# EAGLE design Grove-BLE (dual model) v1.0 (EAGLE 7.1.0)

## Sheet 1 of 2
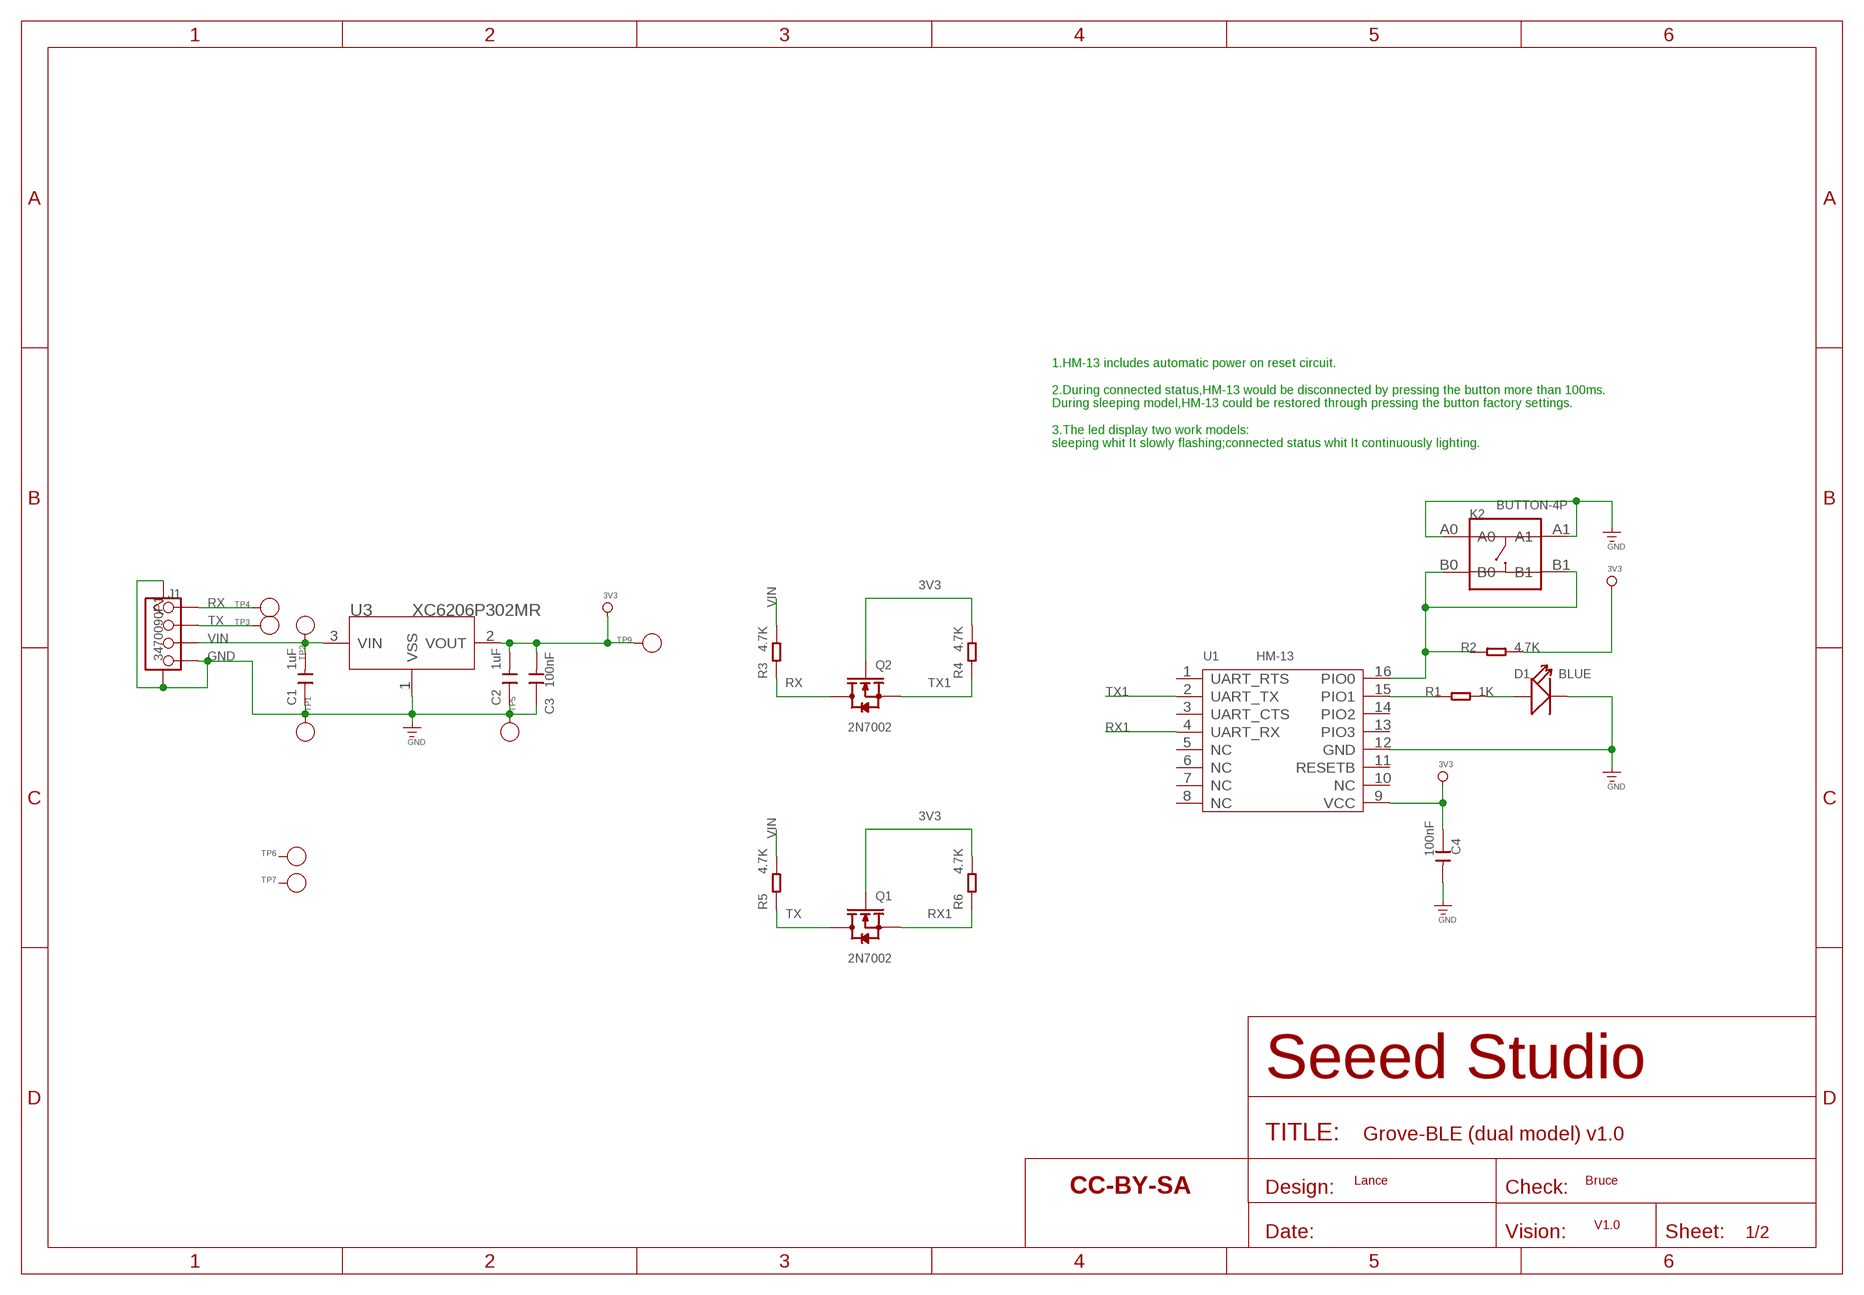
[diagram p0: schematic, sheet 1]

### Parts
C1  1uF  C-0603  [C0603]
C2  1uF  C-0603  [C0603]
C3  100nF  C-0603  [C0603]
C4  100nF  C-0603  [C0603]
D1  BLUE  LED'0603'  [LED-0603]
J1  3470090P1  TWIG-4P-2.0-SMD-FEMALE-REINFORCE'DD'  [4P-SMD-2.0]
K2  BUTTON-4P  BUTTON-4P-3.3X3.3  [4P-SMD-L3.35*W3.35*H1.5MM]
Q1  2N7002  MOSFET-N'SOT23'  [SOT23]
Q2  2N7002  MOSFET-N'SOT23'  [SOT23]
R1  1K  R-0603  [R0603]
R2  4.7K  R-0603  [R0603]
R3  4.7K  R-0603  [R0603]
R4  4.7K  R-0603  [R0603]
R5  4.7K  R-0603  [R0603]
R6  4.7K  R-0603  [R0603]
TP1  GND  PAD-TEST-POINT'4545'  [TP_4545]
TP2  VIN  PAD-TEST-POINT'4545'  [TP_4545]
TP3  RX  PAD-TEST-POINT'4545'  [TP_4545]
TP4  TX  PAD-TEST-POINT'4545'  [TP_4545]
TP5  PAD-TEST-POINT'4545'  [TP_4545]
TP6  PAD-TEST-POINT'4545'  [TP_4545]
TP7  PAD-TEST-POINT'4545'  [TP_4545]
TP9  3V3  PAD-TEST-POINT'4545'  [TP_4545]
U1  HM-13  MOUDLE-BLUETOOTH-HM-13  [16P-L18.5*W13.5*H2.3MM]
U3  XC6206P302MR  XC6206MR  [SOT23]
U$1  SEEEDSTUDIO-OPEN-SCH-FRAME  [SEEEDSTUDIO-PCB-FRAME]

### Nets
3V3: C2.2 C3.2 C4.1 Q1.1(G) Q2.1(G) R2.2 R4.2 R6.2 TP9.T U1.9(VCC) U3.2(VOUT)
GND: C1.1 C2.1 C3.1 C4.2 D1.- J1.4 J1.SS1 J1.SS2 K2.A0 K2.A1 TP1.T TP5.T U1.12(GND) U3.1(VSS)
N$7: R1.1 U1.15(PIO1)
N$8: D1.+ R1.2
N$11: K2.B0 K2.B1 R2.1 U1.16(PIO0)
RX: J1.1 Q2.3(D) R3.1 TP4.T
RX1: Q1.2(S) R6.1 U1.4(UART_RX)
TX: J1.2 Q1.3(D) R5.1 TP3.T
TX1: Q2.2(S) R4.1 U1.2(UART_TX)
VIN: C1.2 J1.3 R3.2 R5.2 TP2.T U3.3(VIN)
Unconnected: TP6.T TP7.T U1.1(UART_RTS) U1.3(UART_CTS) U1.5(NC) U1.6(NC) U1.7(NC) U1.8(NC) U1.10(NC) U1.11(RESETB) U1.13(PIO3) U1.14(PIO2)

### Notes on the sheet
- 1.HM-13 includes automatic power on reset circuit.
   
  2.During connected status,HM-13 would be disconnected by pressing the button more than 100ms.
  During sleeping model,HM-13 could be restored through pressing the button factory settings.
  
  3.The led display two work models:
  sleeping whit It slowly flashing;connected status whit It continuously lighting.
- Lance | Bruce
- V1.0

## Sheet 2 of 2
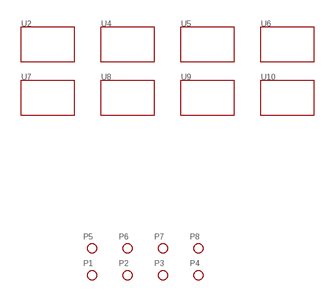
[diagram p1: schematic, sheet 2]

### Parts
P1  PAD-MARK  [ROUND-MARK-1.0]
P2  PAD-MARK  [ROUND-MARK-1.0]
P3  PAD-MARK  [ROUND-MARK-1.0]
P4  PAD-MARK  [ROUND-MARK-1.0]
P5  PAD-MARK  [ROUND-MARK-1.0]
P6  PAD-MARK  [ROUND-MARK-1.0]
P7  PAD-MARK  [ROUND-MARK-1.0]
P8  PAD-MARK  [ROUND-MARK-1.0]
U2  TWIG'2U'  [GROVE-TEST-PLATFORM]
U4  TWIG'2U'  [GROVE-TEST-PLATFORM]
U5  TWIG'2U'  [GROVE-TEST-PLATFORM]
U6  TWIG'2U'  [GROVE-TEST-PLATFORM]
U7  TWIG'2U'  [GROVE-TEST-PLATFORM]
U8  TWIG'2U'  [GROVE-TEST-PLATFORM]
U9  TWIG'2U'  [GROVE-TEST-PLATFORM]
U10  TWIG'2U'  [GROVE-TEST-PLATFORM]

## Library data of the parts
C1-C4 = Discrete:C*: Ceramic Capacitors
D1 = Discrete-new:LED
J1 = Connector :TWIG-4P-2.0-SMD-FEMALE-REINFORCE
K2 = Discrete-new:BUTTON-4P: 4P-L6.0*W6.0*H5.0mm:311020024;4P-L8.0*W8.0*H9.0MM:311020028;4P-SMD-L6.0*W6.0*H5.0MM:311020004;4P-SMD-L3.35*W3.35*H1.5MM:311020030;4P-SMD-L5.2*W5.2*H2.5:311020046
P1-P8 = Discrete:PAD-MARK; PARTNO: DNP
Q1 Q2 = Discrete:MOSFET-N: IRLL014: http://www.vishay.com/docs/91319/sihll014.pdf
R1-R6 = Discrete:R*
TP1-TP7 TP9 = Discrete:PAD-TEST-POINT; PARTNO: DNP
U1 = template:MOUDLE-BLUETOOTH-HM-13: Bluetooth Specification V4.0 EDR and BLE
U2 U4-U10 = template:TWIG
U3 = IC:XC6206: LOW ESR Cap.Compatible Positive Voltage Regulators
U$1 = moudle-new:SEEEDSTUDIO-OPEN-SCH-FRAME

## Board
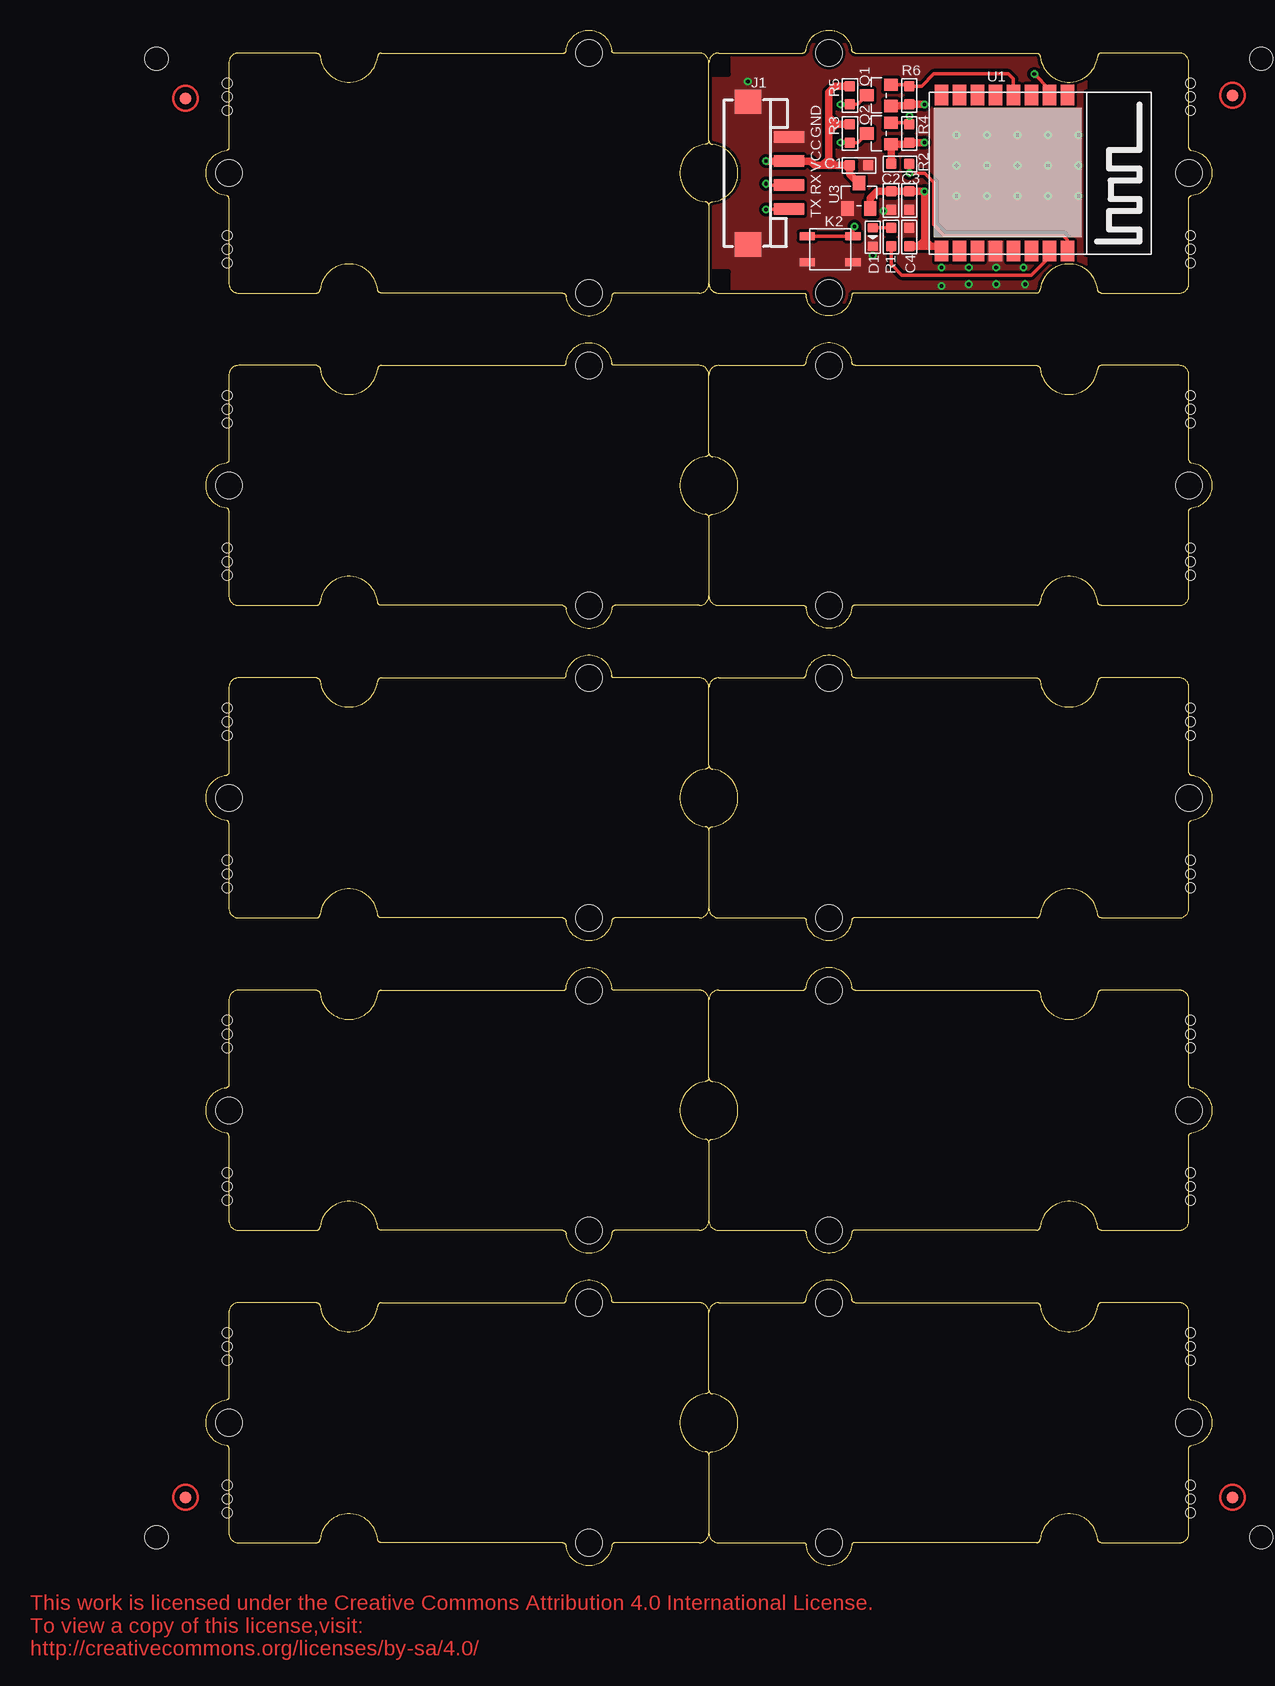
[diagram p2: board, top side]
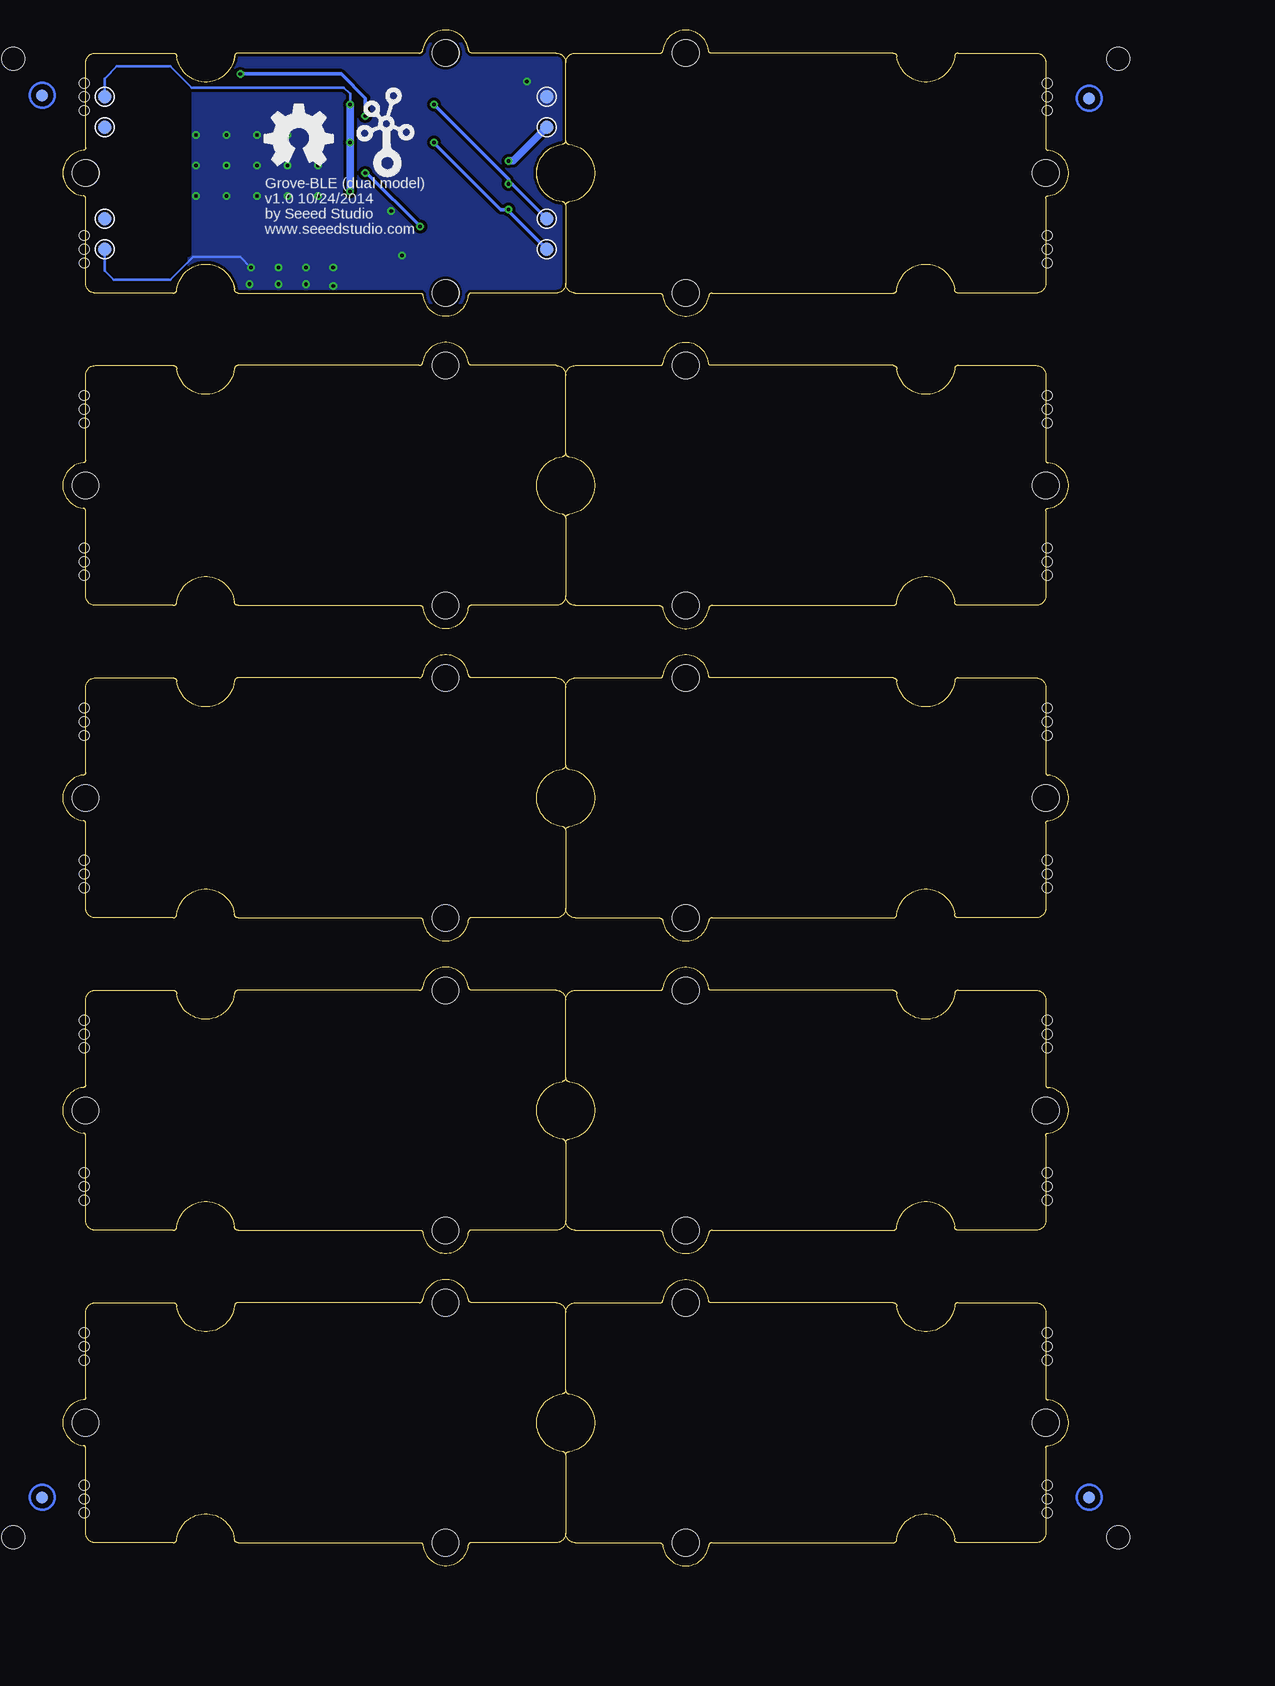
[diagram p3: board, bottom side, seen from below]

Size 83.82 x 127.98 mm. Coordinates in mm from the lower left corner, seen from the top.
Copper layers (1*16): Top 0.035mm / dielectric 1.5mm / Bottom 0.035mm
Design rules "SeeedStudio_2layer_DRU_no_angle_20140221 *": minimum track width 6mil, minimum drill 12mil, track to track 6mil, track to pad 6mil, pad to pad 6mil, via to via 6mil, smd to smd 0mil, copper to edge 10mil, drill to drill 10mil, minimum pad ring 10mil, minimum via ring 6mil, stop-mask expansion 2mil, vias tented up to drill 100mil, thermal gap 10mil
Holes 0.8 mm at 1.78,123.55 1.78,121.27 1.78,122.41 1.78,110.85 1.78,108.57 1.78,109.71 1.78,97.52 1.78,95.23 1.78,96.38 1.78,84.82 1.78,82.53 1.78,83.68 1.78,71.48 1.78,69.2 1.78,70.34 1.78,58.78 1.78,56.5 1.78,57.64 1.78,45.45 1.78,43.16 1.78,44.31 1.78,32.75 1.78,30.46 1.78,31.61 1.78,19.41 1.78,17.13 1.78,18.27 1.78,6.71 1.78,4.43 1.78,5.57 82.04,121.27 82.04,123.55 82.04,122.41 82.04,108.57 82.04,110.85 82.04,109.71 82.04,95.23 82.04,97.52 82.04,96.38 82.04,82.53 82.04,84.82 82.04,83.68 82.04,69.2 82.04,71.48 82.04,70.34 82.04,56.5 82.04,58.78 82.04,57.64 82.04,43.16 82.04,45.45 82.04,44.31 82.04,30.46 82.04,32.75 82.04,31.61 82.04,17.13 82.04,19.41 82.04,18.27 82.04,4.43 82.04,6.71 82.04,5.57
Holes 1.91 mm at -4.13,2.4 87.95,2.4 87.95,125.59 -4.13,125.59

### Footprints (pad centres in the part's own frame; a part is rotated, then mirrored left to right if it is on the bottom)
C0603 = smd 0.889 x 0.889: 1 -0.762,0; 2 0.762,0
LED-0603 = smd 0.762 x 0.889: + -0.762,0; - 0.762,0
4P-SMD-2.0 = smd 0.965 x 2.54: 1 -3,0; 2 -1,0; 3 1,0; 4 3,0 | smd 2.032 x 2.184: SS1 -5.946,3.4; SS2 5.946,3.4
4P-SMD-L3.35*W3.35*H1.5MM = smd 1.27 x 0.635: A0 -1.905,1.079; A1 1.905,1.079; B0 -1.905,-1.079; B1 1.905,-1.079
ROUND-MARK-1.0 = smd 1.016 x 1.016: P$1 0,0
SOT23 = smd 1.016 x 1.143: 1 -0.889,-1.016; 2 0.889,-1.016; 3 0,1.016
R0603 = smd 0.889 x 0.889: 1 -0.762,0; 2 0.762,0
TP_4545 = smd 1.143 x 1.143: T 0,0
16P-L18.5*W13.5*H2.3MM = smd 1.7 x 1.1: 1 -6.5,2.25; 2 -6.5,0.75; 3 -6.5,-0.75; 4 -6.5,-2.25; 5 -6.5,-3.75; 6 -6.5,-5.25; 7 -6.5,-6.75; 8 -6.5,-8.25; 9 6.5,-8.25; 10 6.5,-6.75; 11 6.5,-5.25; 12 6.5,-3.75; 13 6.5,-2.25; 14 6.5,-0.75; 15 6.5,0.75; 16 6.5,2.25
GROVE-TEST-PLATFORM = hole 2.2: -10,-10; -10,10; 20,0
SOT23' = smd 1.016 x 1.2: 1 -0.95,-1.06; 2 0.95,-1.06; 3 0,1.06
GROVE-TEST-PLATFORM@1 = hole 2.2: -10,-10; -10,10; 20,0
GROVE-1*2-TEST-PLATFORM = hole 2.2: -10,-10; -10,10; 20,0

### Placement (x,y rotation side)
C1  54.41,116.7 180 top
C2  57.09,113.77 90 top
C3  58.61,113.77 90 top
C4  58.61,110.73 90 top
D1  55.56,110.73 270 top
J1  48.57,116.06 90 top
K2  52.01,109.71 180 top
P1  -1.71,5.7 0 top
P2  85.54,5.7 0 top
P3  -1.71,122.28 0 top
P4  85.54,122.54 0 top
P5  -1.71,5.7 0 bottom
P6  85.54,5.7 0 bottom
P7  85.54,122.54 0 bottom
P8  -1.71,122.28 0 bottom
Q1  56.07,122.54 90 top
Q2  56.07,119.36 90 top
R1  57.09,110.73 90 top
R2  57.85,116.82 180 top
R3  53.66,119.36 90 top
R4  58.61,119.36 270 top
R5  53.66,122.54 90 top
R6  58.61,122.54 270 top
TP1  43.49,122.41 180 bottom
TP2  43.5,119.87 180 bottom
TP3  43.5,112.25 270 bottom
TP4  43.5,109.71 180 bottom
TP5  80.33,109.71 180 bottom
TP6  80.33,112.25 180 bottom
TP7  80.33,119.87 180 bottom
TP9  80.33,122.41 0 bottom
U1  69.53,116.06 270 top
U2  61.91,37.96 0 top
U3  XC6206P302MR  [SOT23']  54.41,114.16 0 top
U4  21.91,37.96 180 top
U5  61.91,63.99 0 top
U6  21.91,63.99 180 top
U7  61.91,90.03 0 top
U8  21.91,90.03 180 top
U9  21.91,116.06 180 top
U10  61.91,116.06 0 top
U11  [GROVE-TEST-PLATFORM@1]  61.91,11.92 0 top
U12  [GROVE-TEST-PLATFORM@1]  21.91,11.92 180 top
U$1  -14.67,-7.51 0 top  (outside the outline)
U$5  [GROVE-1*2-TEST-PLATFORM]  61.91,116.06 0 top
U$6  [OSHW_FILLX200_NOTEXT]  66.99,116.7 0 bottom
U$7  [TWIGLOGO]  56.83,116.7 0 bottom

### Tracks (layer width: path | path; a pad name or v marks a point on that pad's centre or on a via)
3V3  (via drill 0.3 pad 0.64)
  Top 0.61: Q1.1 58.48,121.65 R6.2 v59.88,121.78 | U3.2 55.37,113.96 55.94,114.54 C2.2 C3.2 v59.88,114.53 v59.88,114.54 59.88,110.47 | 59.88,110.47 59.88,109.97 | C4.1 59.37,109.97 | 59.37,109.97 59.88,109.97 | 59.88,109.97 60.39,109.97 | 60.39,109.97 60.88,109.97 U1.9 | 59.88,110.47 59.37,109.97 | 59.88,110.47 60.39,109.97 | v59.88,118.6 R4.2 58.48,118.47 Q2.1 R2.2
  Bottom 0.203: TP9.T 80.33,123.94 79.31,124.95 74.87,124.95 73.09,123.17 61.15,123.17 61.02,123.17 60.39,123.17 59.88,122.67 v59.88,121.78
  Bottom 0.61: v59.88,121.78 v59.88,118.6 v59.88,114.54
GND  (via drill 0.3 pad 0.64)
  Bottom 0.203: TP5.T 80.33,107.93 79.57,107.17 74.87,107.17 72.96,109.08 69.03,109.08 v68.14,108.19
  other vias: 45.15,123.68 55.56,109.2 56.45,112.89 62.55,119.24 65.09,119.24 67.63,119.24 70.17,119.24 72.71,119.24 72.71,116.7 62.55,116.7 65.09,116.7 67.63,116.7 70.17,116.7 70.17,114.16 67.63,114.16 65.09,114.16 62.55,114.16 65.85,108.19 68.26,106.79 63.56,108.19 61.28,108.19 61.28,106.66 63.56,106.79 65.85,106.79 72.71,114.16
  pour Top (isolate 0.254, rank 6, no thermals): 41.47,126.86 73.34,126.86 73.34,105.27 41.47,105.27
  pour Bottom (isolate 0.254, rank 6, no thermals): 41.47,126.86 73.34,126.86 73.34,105.27 41.47,105.27
N$7
  Top 0.305: U1.15 70.28,109.06 68.77,107.55 57.98,107.55 57.09,108.44 R1.1
N$8
  Top 0.305: R1.2 D1.+
N$11  (via drill 0.3 pad 0.64)
  Top 0.305: v54.04,111.62 53.91,111.49 K2.B0 K2.B1 | R2.1 v58.61,116.06 59.88,116.06 60.64,115.3 60.64,111.74 61.53,110.85 71.44,110.85 71.78,110.51 U1.16
  Bottom 0.305: v58.61,116.06 58.48,116.06 v54.04,111.62
RX  (via drill 0.3 pad 0.64)
  Top 0.305: Q2.3 54.29,118.6 R3.1 v52.9,118.6 | J1.1 46.72,113.06 v46.67,113.01
  Bottom 0.305: TP4.T 46.67,112.89 v46.67,113.01 47.31,113.01 v52.9,118.6
RX1
  Top 0.305: Q1.2 58.48,123.43 R6.1 59.63,123.3 60.64,124.32 66.87,124.32 67.28,123.9 U1.4
TX  (via drill 0.3 pad 0.64)
  Top 0.305: Q1.3 54.29,121.78 R5.1 v52.9,121.78 | J1.2 46.78,115.06 v46.67,115.17
  Bottom 0.305: v52.9,121.78 46.67,115.55 v46.67,115.17 46.42,115.17 TP3.T
TX1  (via drill 0.3 pad 0.64)
  Top 0.305: Q2.2 58.48,120.25 R4.1 v58.61,120.82 | U1.2 70.28,123.06 v69.03,124.32
  Bottom 0.305: v58.61,120.82 58.61,122.31 60.62,124.32 v69.03,124.32
VIN  (via drill 0.3 pad 0.64)
  Top 0.61: 52.39,116.7 C1.2 53.65,115.98 U3.3 | 52.39,116.7 51.88,116.7 | 51.88,120.13 51.88,122.79 52.39,123.3 R5.2 | 51.88,120.13 51.88,119.49 | 51.88,119.49 51.88,117.2 | 51.88,117.2 51.88,116.7 | 51.88,116.7 51.37,116.7 | 51.37,116.7 50.72,116.7 50.36,117.06 J1.3 46.69,117.06 v46.67,117.08 | 51.88,117.2 51.37,116.7 | 51.88,117.2 52.39,116.7 | 52.52,120.13 51.88,120.13 | 52.52,120.13 52.01,120.63 | 52.52,120.13 51.88,119.49 | R3.2 52.52,120.13
  Bottom 0.61: v46.67,117.08 46.29,117.08 TP2.T

### Text on the board
tPlace: GND | VCC | RX | TX
bPlace: Grove-BLE (dual model) | v1.0 10/24/2014 | by Seeed Studio | www.seeedstudio.com